# EAGLE design pishield (EAGLE 6.5.0)
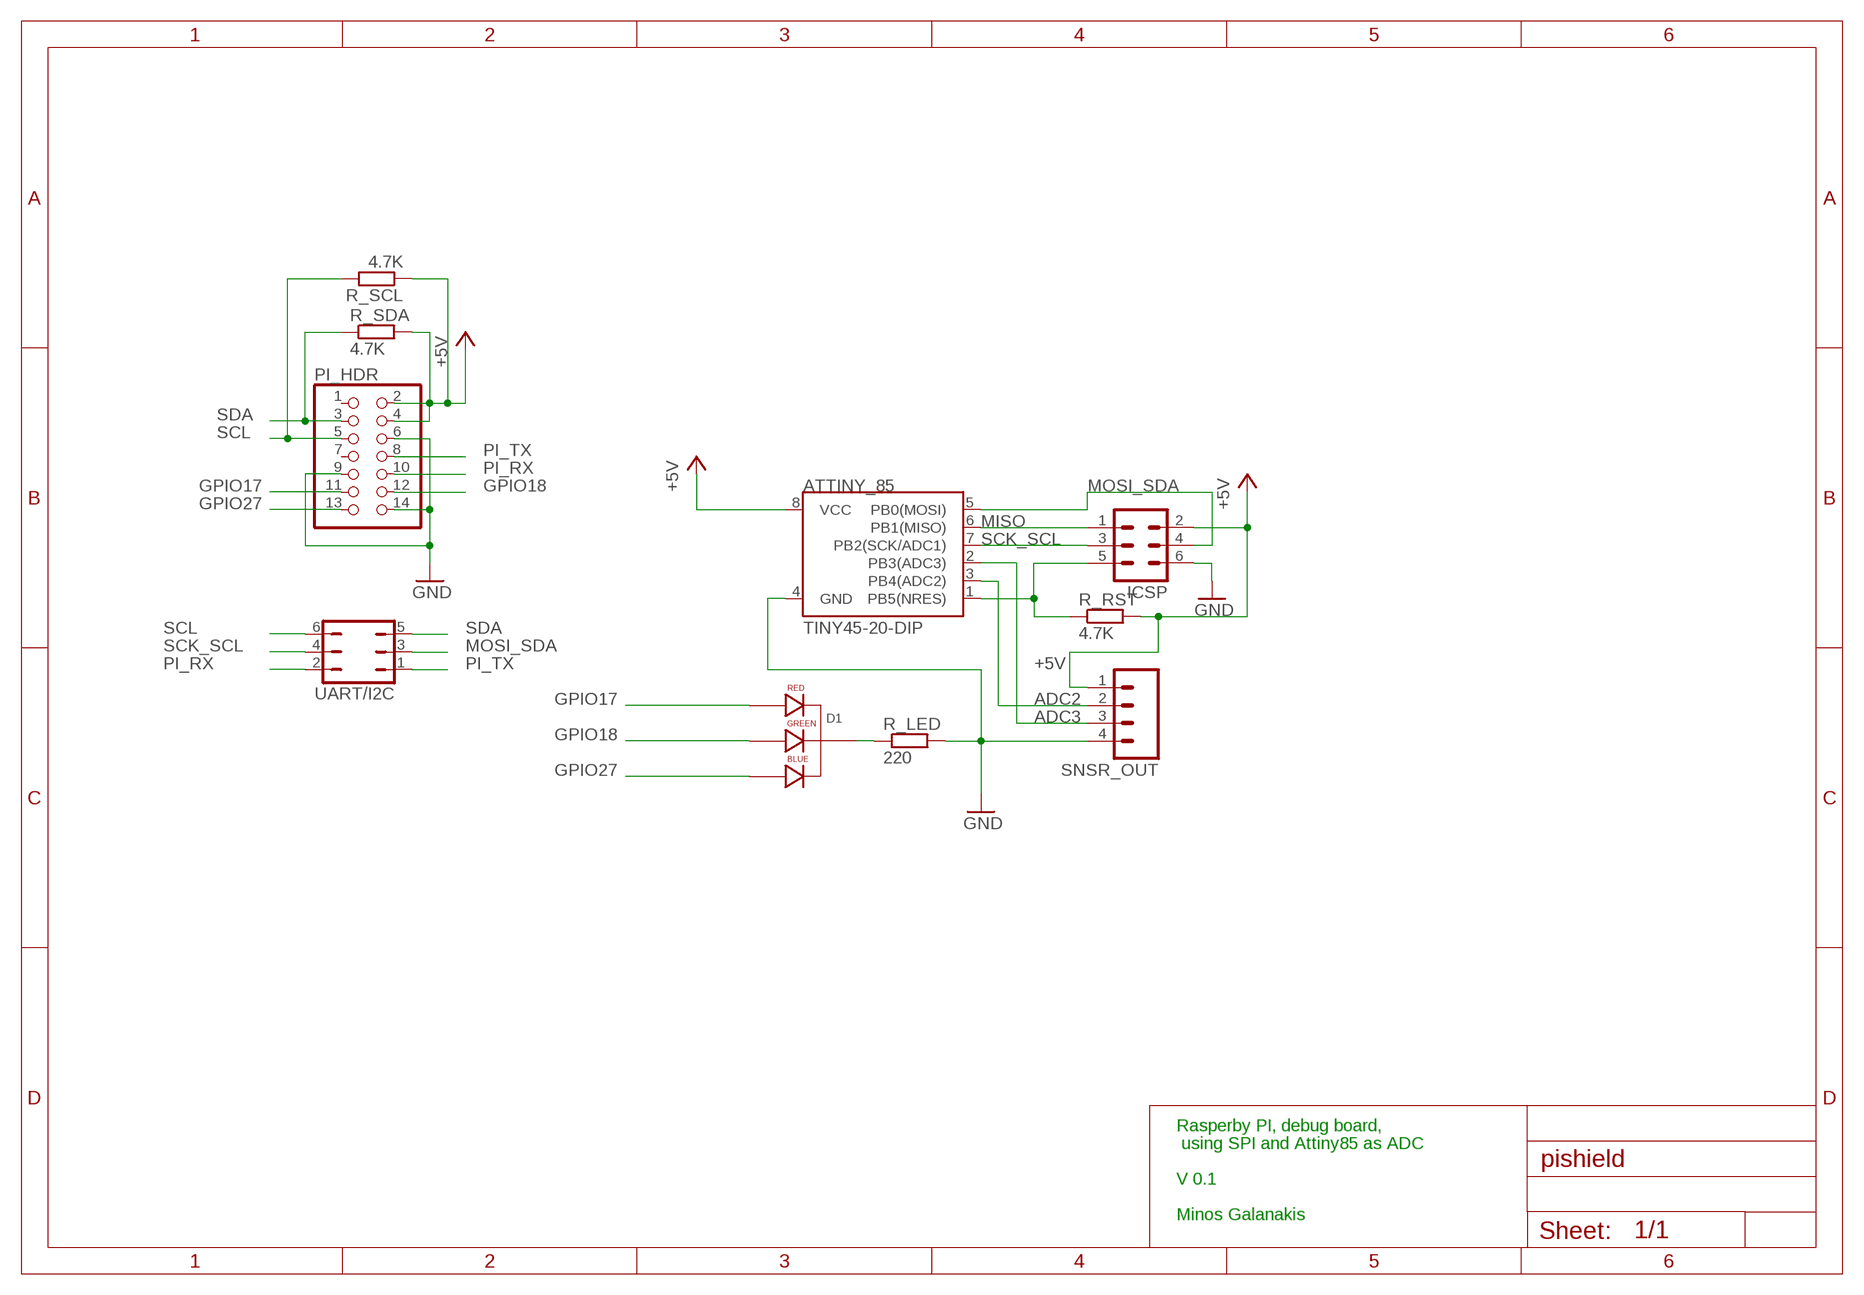
[diagram p0: schematic, sheet 1]

## Parts
ATTINY_85  TINY45-20-DIP  ATTINY45TINY45-20-DIP  [DIP08]
D1  LED-RGB-CC-THRUCLEAR  [LED-RGB-THRU]
ICSP  MA03-2  [MA03-2]
PI_HDR  PINHD-2X7  [2X07]
R_LED  220  R-EU_0204/7  [0204/7]
R_RST  4.7K  R-EU_0204/7  [0204/7]
R_SCL  4.7K  R-EU_0204/7  [0204/7]
R_SDA  4.7K  R-EU_0204/7  [0204/7]
SNSR_OUT  M04LONGPADS  [1X04_LONGPADS]
UART/I2C  JP3Q  [JP3Q]

## Nets
+5V: ATTINY_85.8(VCC) ICSP.2 PI_HDR.2 PI_HDR.4 R_RST.2 R_SCL.1 R_SDA.2 SNSR_OUT.1
ADC2: ATTINY_85.3(PB4(ADC2)) SNSR_OUT.2
ADC3: ATTINY_85.2(PB3(ADC3)) SNSR_OUT.3
GND: ATTINY_85.4(GND) ICSP.6 PI_HDR.6 PI_HDR.9 PI_HDR.14 R_LED.2 SNSR_OUT.4
GPIO17: D1.1(RED_CATHODE) PI_HDR.11
GPIO18: D1.3(GREEN_CATHODE) PI_HDR.12
GPIO27: D1.4(BLUE_CATHODE) PI_HDR.13
MISO: ATTINY_85.6(PB1(MISO)) ICSP.1
MOSI_SDA: ATTINY_85.5(PB0(MOSI)) ICSP.4 UART/I2C.3
N$8: D1.2(CATHODE) R_LED.1
N$9: ATTINY_85.1(PB5(NRES)) ICSP.5 R_RST.1
PI_RX: PI_HDR.10 UART/I2C.2
PI_TX: PI_HDR.8 UART/I2C.1
SCK_SCL: ATTINY_85.7(PB2(SCK/ADC1)) ICSP.3 UART/I2C.4
SCL: PI_HDR.5 R_SCL.2 UART/I2C.6
SDA: PI_HDR.3 R_SDA.1 UART/I2C.5
Unconnected: PI_HDR.1 PI_HDR.7

## Notes on the sheet
- Rasperby PI, debug board,
- using SPI and Attiny85 as ADC
- V 0.1
- Minos Galanakis

## Library data of the parts
ATTINY_85 = SparkFun-DigitalIC:ATTINY45: Atmel 8-pin 2/4/8kB flash uC; PROD_ID: IC-09439
D1 = SparkFun-LED:LED-RGB-CC-THRU: RGB Through-hole common cathode LED SparkFun Storefront: COM-00105 (Clear) COM-09264 (Diffuse); PROD_ID: DIO-08418
ICSP = con-lstb:MA03-2: PIN HEADER; OC_FARNELL: unknown; OC_NEWARK: unknown
PI_HDR = pinhead:PINHD-2X7: PIN HEADER
R_LED R_RST R_SCL R_SDA = resistor:R-EU_: RESISTOR, European symbol
SNSR_OUT = SparkFun-Connectors:M04: Header 4 Standard 4-pin 0.1" header. Use with straight break away headers (SKU : PRT-00116), right angle break away headers (PRT-00553), swiss pins (PRT-00743), machine pins (PRT-00117), and female headers (PRT-00115). Molex polarized connector foot print use with SKU : PRT-08231 with associated crimp pins and housings. 1MM SMD Version SKU: PRT-10208
UART/I2C = jumper:JP3Q: JUMPER

## Board
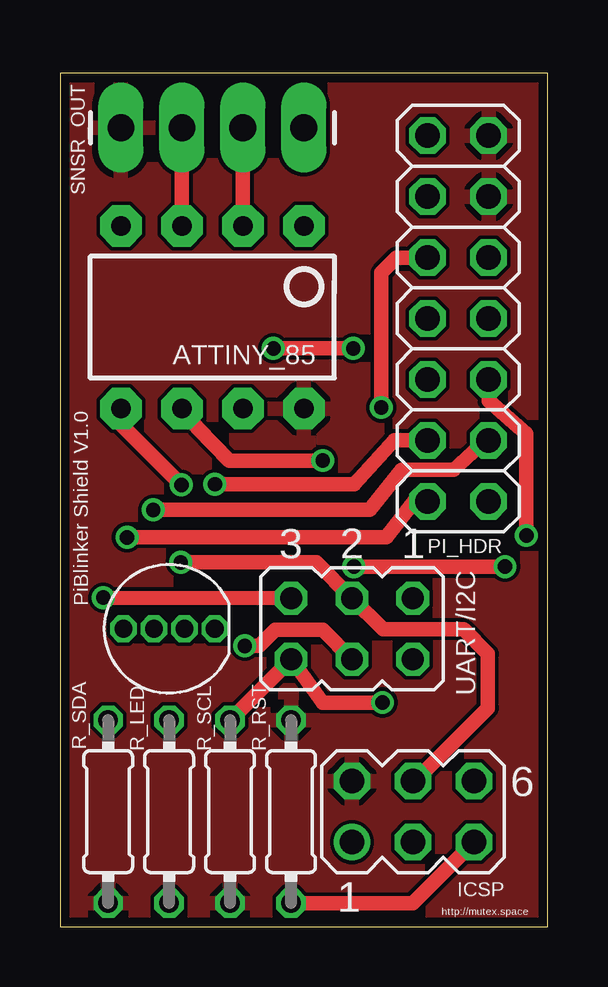
[diagram p1: board, top side]
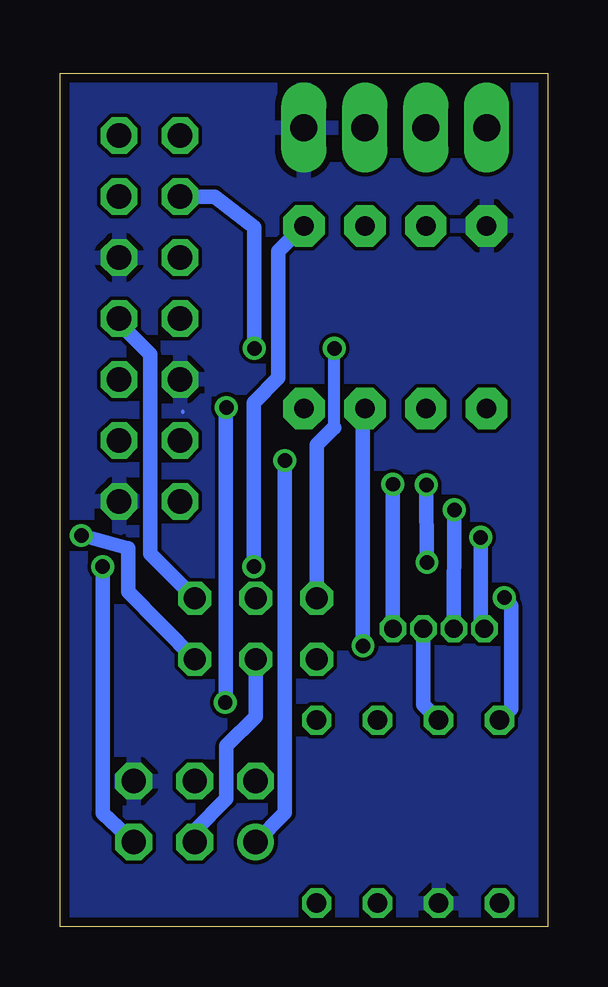
[diagram p2: board, bottom side, seen from below]

Size 20.32 x 35.56 mm. Coordinates in mm from the lower left corner, seen from the top.
Outline: 0,0 20.32,0 20.32,35.56 0,35.56 0,0
Copper layers (1*16): Top 0.0356mm / dielectric 1.5011mm / Bottom 0.0356mm
Design rules "LaenPCBOrder": minimum track width 6mil, minimum drill 13mil, track to track 6mil, track to pad 6mil, pad to pad 6mil, via to via 6mil, smd to smd 6mil, copper to edge 15mil, drill to drill 6mil, minimum pad ring 7mil, minimum via ring 7mil, stop-mask expansion 3mil, vias tented up to drill 0mil, thermal gap 10mil

### Footprints (pad centres in the part's own frame; a part is rotated, then mirrored left to right if it is on the bottom)
DIP08 = drill 0.813 pad 1.727 octagon: 1 -3.81,-3.81; 2 -1.27,-3.81; 3 1.27,-3.81; 4 3.81,-3.81; 5 3.81,3.81; 6 1.27,3.81; 7 -1.27,3.81; 8 -3.81,3.81
LED-RGB-THRU = drill 0.737 octagon: 1 1.905,0; 2 0.635,0; 3 -0.635,0; 4 -1.905,0
MA03-2 = drill 1.016: 1 -2.54,-1.27 | drill 1.016 octagon: 2 -2.54,1.27; 3 0,-1.27; 4 0,1.27; 5 2.54,-1.27; 6 2.54,1.27
2X07 = drill 1.016 octagon: 1 -7.62,-1.27; 2 -7.62,1.27; 3 -5.08,-1.27; 4 -5.08,1.27; 5 -2.54,-1.27; 6 -2.54,1.27; 7 0,-1.27; 8 0,1.27; 9 2.54,-1.27; 10 2.54,1.27; 11 5.08,-1.27; 12 5.08,1.27; 13 7.62,-1.27; 14 7.62,1.27
0204/7 = drill 0.813 octagon: 1 -3.81,0; 2 3.81,0
1X04_LONGPADS = drill 1.118 pad 1.88 long: 1 0,0; 2 2.54,0; 3 5.08,0; 4 7.62,0
JP3Q = drill 0.914 octagon: 1 -2.54,-1.27; 2 -2.54,1.27; 3 0,-1.27; 4 0,1.27; 5 2.54,-1.27; 6 2.54,1.27

### Placement (x,y rotation side)
ATTINY_85  6.35,25.4 180 top
D1  4.55,12.42 0 top
ICSP  14.71,4.8 0 top
PI_HDR  16.59,25.35 270 top
R_LED  4.55,4.8 270 top
R_RST  9.63,4.8 90 top
R_SCL  7.09,4.8 90 top
R_SDA  2.01,4.8 270 top
SNSR_OUT  2.54,33.3 0 top
UART/I2C  12.17,12.42 180 top

### Tracks (layer width: path | path; a pad name or v marks a point on that pad's centre or on a via)
+5V
  pour Top: 0,35.56 20.32,35.56 20.32,0 0,0
ADC2
  Top 0.61: SNSR_OUT.2 ATTINY_85.3
ADC3
  Top 0.61: SNSR_OUT.3 ATTINY_85.2
GND
  Bottom 0.152: 15.21,21.44 15.21,21.49
  pour Bottom: 0,35.56 20.32,35.56 20.32,0 0,0
GPIO17  (via drill 0.6)
  Top 0.61: PI_HDR.11 13.92,20.27 12.27,18.44 v6.45,18.44
  Bottom 0.61: v6.45,18.44 D1.1
GPIO18  (via drill 0.6)
  Top 0.61: PI_HDR.12 17.73,20.27 16.41,19.05 14.25,19.05 12.9,17.37 v3.89,17.37
  Bottom 0.61: v3.89,17.37 D1.3
GPIO27  (via drill 0.6)
  Top 0.61: PI_HDR.13 14.76,17.73 13.59,16.23 v2.79,16.23
  Bottom 0.61: v2.79,16.23 2.79,12.57 D1.4
MISO  (via drill 0.6)
  Top 0.61: ATTINY_85.6 5.74,20.78 7.06,19.43 v10.95,19.43
  Bottom 0.61: v10.95,19.43 10.95,4.75 ICSP.1
MOSI_SDA  (via drill 0.6)
  Top 0.152: ATTINY_85.5 2.52,21.44 2.44,21.36
  Top 0.61: v5.03,15.19 10.67,15.19 UART/I2C.3 13.46,12.39 16.82,12.39 17.83,11.38 17.83,9.12 14.78,6.07 ICSP.4 | 2.44,21.36 2.44,21.03 v5.05,18.41
  Bottom 0.61: v5.05,18.41 v5.03,15.19
N$8
  Bottom 0.61: D1.2 5.18,9.25 R_LED.1
N$9  (via drill 0.6)
  Top 0.61: v12.24,15.01 v18.54,15.01 | R_RST.1 14.71,0.99 ICSP.5
  Bottom 0.61: ATTINY_85.1 11.23,28.14 11.23,22.89 12.24,21.84 v12.24,15.01 | v18.54,15.01 18.54,4.72 ICSP.5
PI_RX  (via drill 0.6)
  Top 0.61: PI_HDR.10 17.86,21.92 19.43,20.55 v19.43,16.31
  Bottom 0.61: v19.43,16.31 17.48,15.77 17.48,13.97 UART/I2C.2
PI_TX
  Bottom 0.61: PI_HDR.8 17.86,25.15 16.56,23.85 16.56,15.54 UART/I2C.1
SCK_SCL  (via drill 0.6)
  Top 0.61: v7.7,11.71 8.31,11.71 8.97,12.37 10.95,12.37 UART/I2C.4
  Bottom 0.61: ICSP.3 14.71,4.01 13.39,5.33 13.39,7.54 12.17,8.76 UART/I2C.4 | ATTINY_85.7 7.7,21.59 v7.7,11.71
SCL  (via drill 0.6)
  Top 0.61: R_SCL.2 UART/I2C.6 10.95,9.35 v13.44,9.35 | PI_HDR.5 14.02,27.89 13.39,27.25 v13.39,21.64
  Bottom 0.61: v13.39,21.64 13.41,21.61 13.41,9.37 v13.44,9.35
SDA  (via drill 0.6)
  Top 0.61: UART/I2C.5 v1.8,13.72 | v8.89,24.11 v12.22,24.11
  Bottom 0.508: 8.89,20.8 v8.89,24.11
  Bottom 0.61: UART/I2C.5 9.63,20.09 8.91,20.8 8.89,20.8 | v12.22,24.11 12.22,29.16 13.87,30.43 PI_HDR.3 | v1.8,13.72 1.52,13.39 1.52,9.09 R_SDA.1

### Text on the board
tNames: PiBlinker Shield V1.0 | http://mutex.space